# EAGLE design PCB_0015 (EAGLE 9.6.2)
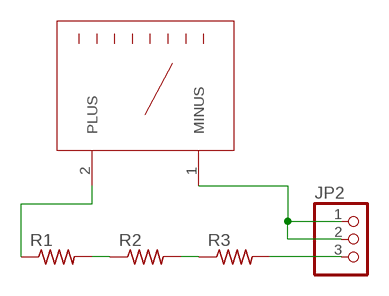
[diagram p0: schematic, sheet 1]

## Parts
JP2  PINHD-1X3  [1X03]
R1  R-US_R0603  [R0603]
R2  R-US_R0603  [R0603]
R3  R-US_R0603  [R0603]
U$1  METER  [METER_85C1]

## Nets
N$1: JP2.1 JP2.2 U$1.1(MINUS)
N$2: R1.1 U$1.2(PLUS)
N$3: JP2.3 R3.2
N$4: R2.2 R3.1
N$5: R1.2 R2.1

## Library data of the parts
JP2 = pinhead:PINHD-1X3: PIN HEADER
R1-R3 = rcl:R-US_: RESISTOR, American symbol; SPICEPREFIX: R
U$1 = SerialWombat_F360_Library:METER

## Board
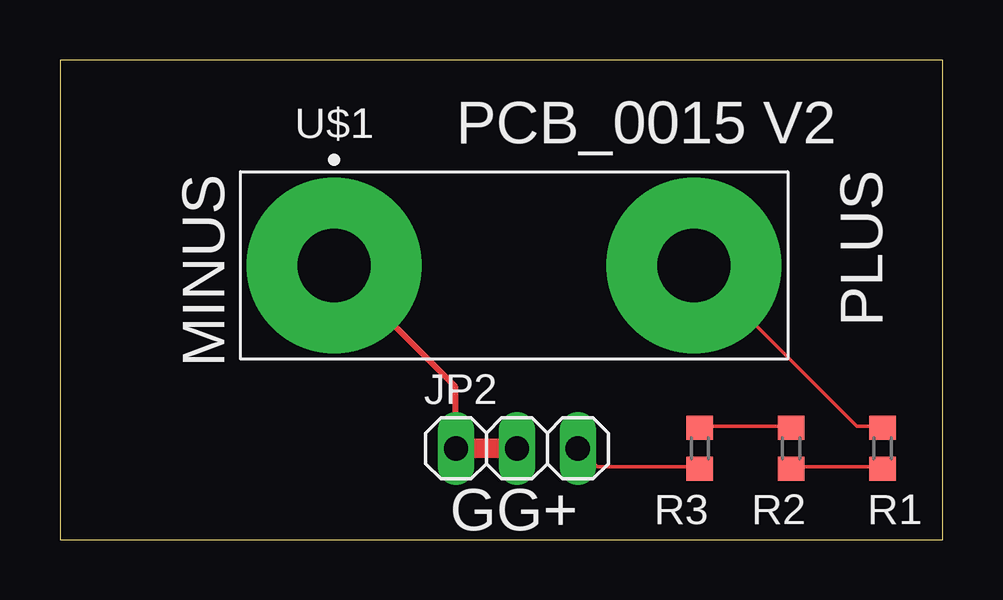
[diagram p1: board, top side]
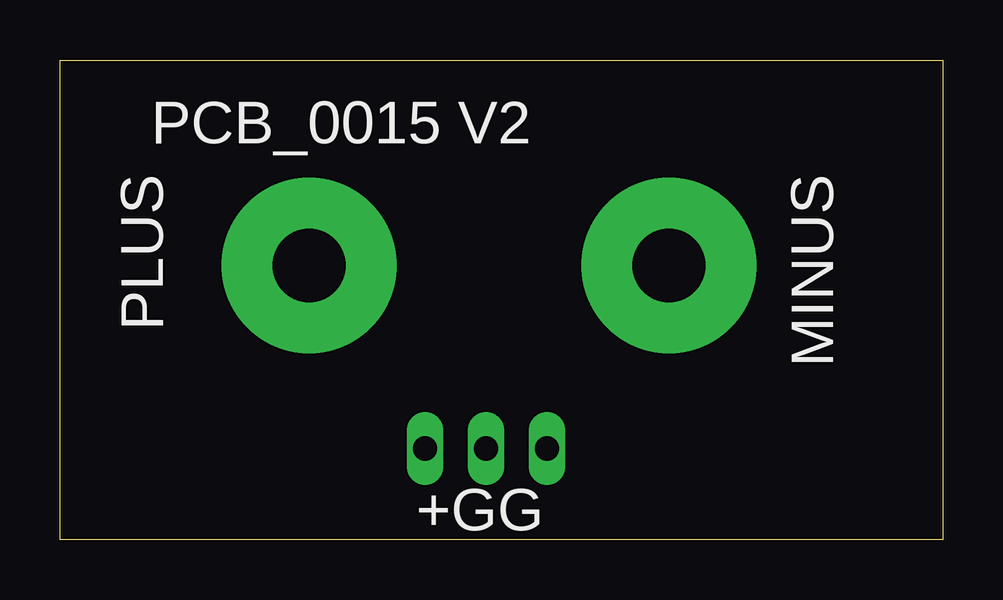
[diagram p2: board, bottom side, seen from below]

Size 36.81 x 19.99 mm. Coordinates in mm from the lower left corner, seen from the top.
Outline: 0,0 36.81,0 36.81,19.99 0,19.99 0,0
Copper layers (1*16): Top 0.035mm / dielectric 1.5mm / Bottom 0.035mm
Design rules "default": minimum track width 6mil, minimum drill 0.35mm, track to track 6mil, track to pad 6mil, pad to pad 6mil, via to via 6mil, smd to smd 6mil, copper to edge 40mil, drill to drill 6mil, minimum pad ring 10mil, minimum via ring 8mil, stop-mask expansion 4mil, vias tented up to drill 0mil, thermal gap 10mil

### Footprints (pad centres in the part's own frame; a part is rotated, then mirrored left to right if it is on the bottom)
1X03 = drill 1.016 long: 1 -2.54,0; 2 0,0; 3 2.54,0
R0603 = smd 1 x 1.1: 1 -0.85,0; 2 0.85,0
METER_85C1 = drill 3.048 pad 7.3: 1 0,0; 2 15,0

### Placement (x,y rotation side)
JP2  19.05,3.81 0 top
R1  34.29,3.81 270 top
R2  30.48,3.81 90 top
R3  26.67,3.81 270 top
U$1  11.43,11.43 0 top

### Tracks (layer width: path | path; a pad name or v marks a point on that pad's centre or on a via)
N$1
  Top 0.152: 16.46,3.81 JP2.1
  Top 0.254: 16.46,3.81 16.46,6.4 U$1.1
  Top 0.813: JP2.2 JP2.1
N$2
  Top 0.152: R1.1 34.29,4.72 33.22,4.72 26.52,11.43 U$1.2
N$3
  Top 0.152: R3.2 26.67,3.05 22.4,3.05 21.64,3.81 JP2.3
N$4
  Top 0.152: R3.1 26.67,4.72 30.48,4.72 R2.2
N$5
  Top 0.152: R2.1 30.48,3.05 34.29,3.05 R1.2

### Text on the board
tPlace: PCB_0015 V2 | MINUS | PLUS | GG+
bPlace: PCB_0015 V2 | MINUS | PLUS | +GG